# Altium schematic sheet 04_RFDiagram.SchDoc: RF diagram
size A3; Organization: Lime Microsystems; Address1: Surrey Tech Centre; Address2: Guildford GU2 7YG; Address3: Surrey; Address4: United Kingdom; Revision: v1.1; SheetNumber: 1; SheetTotal: 11
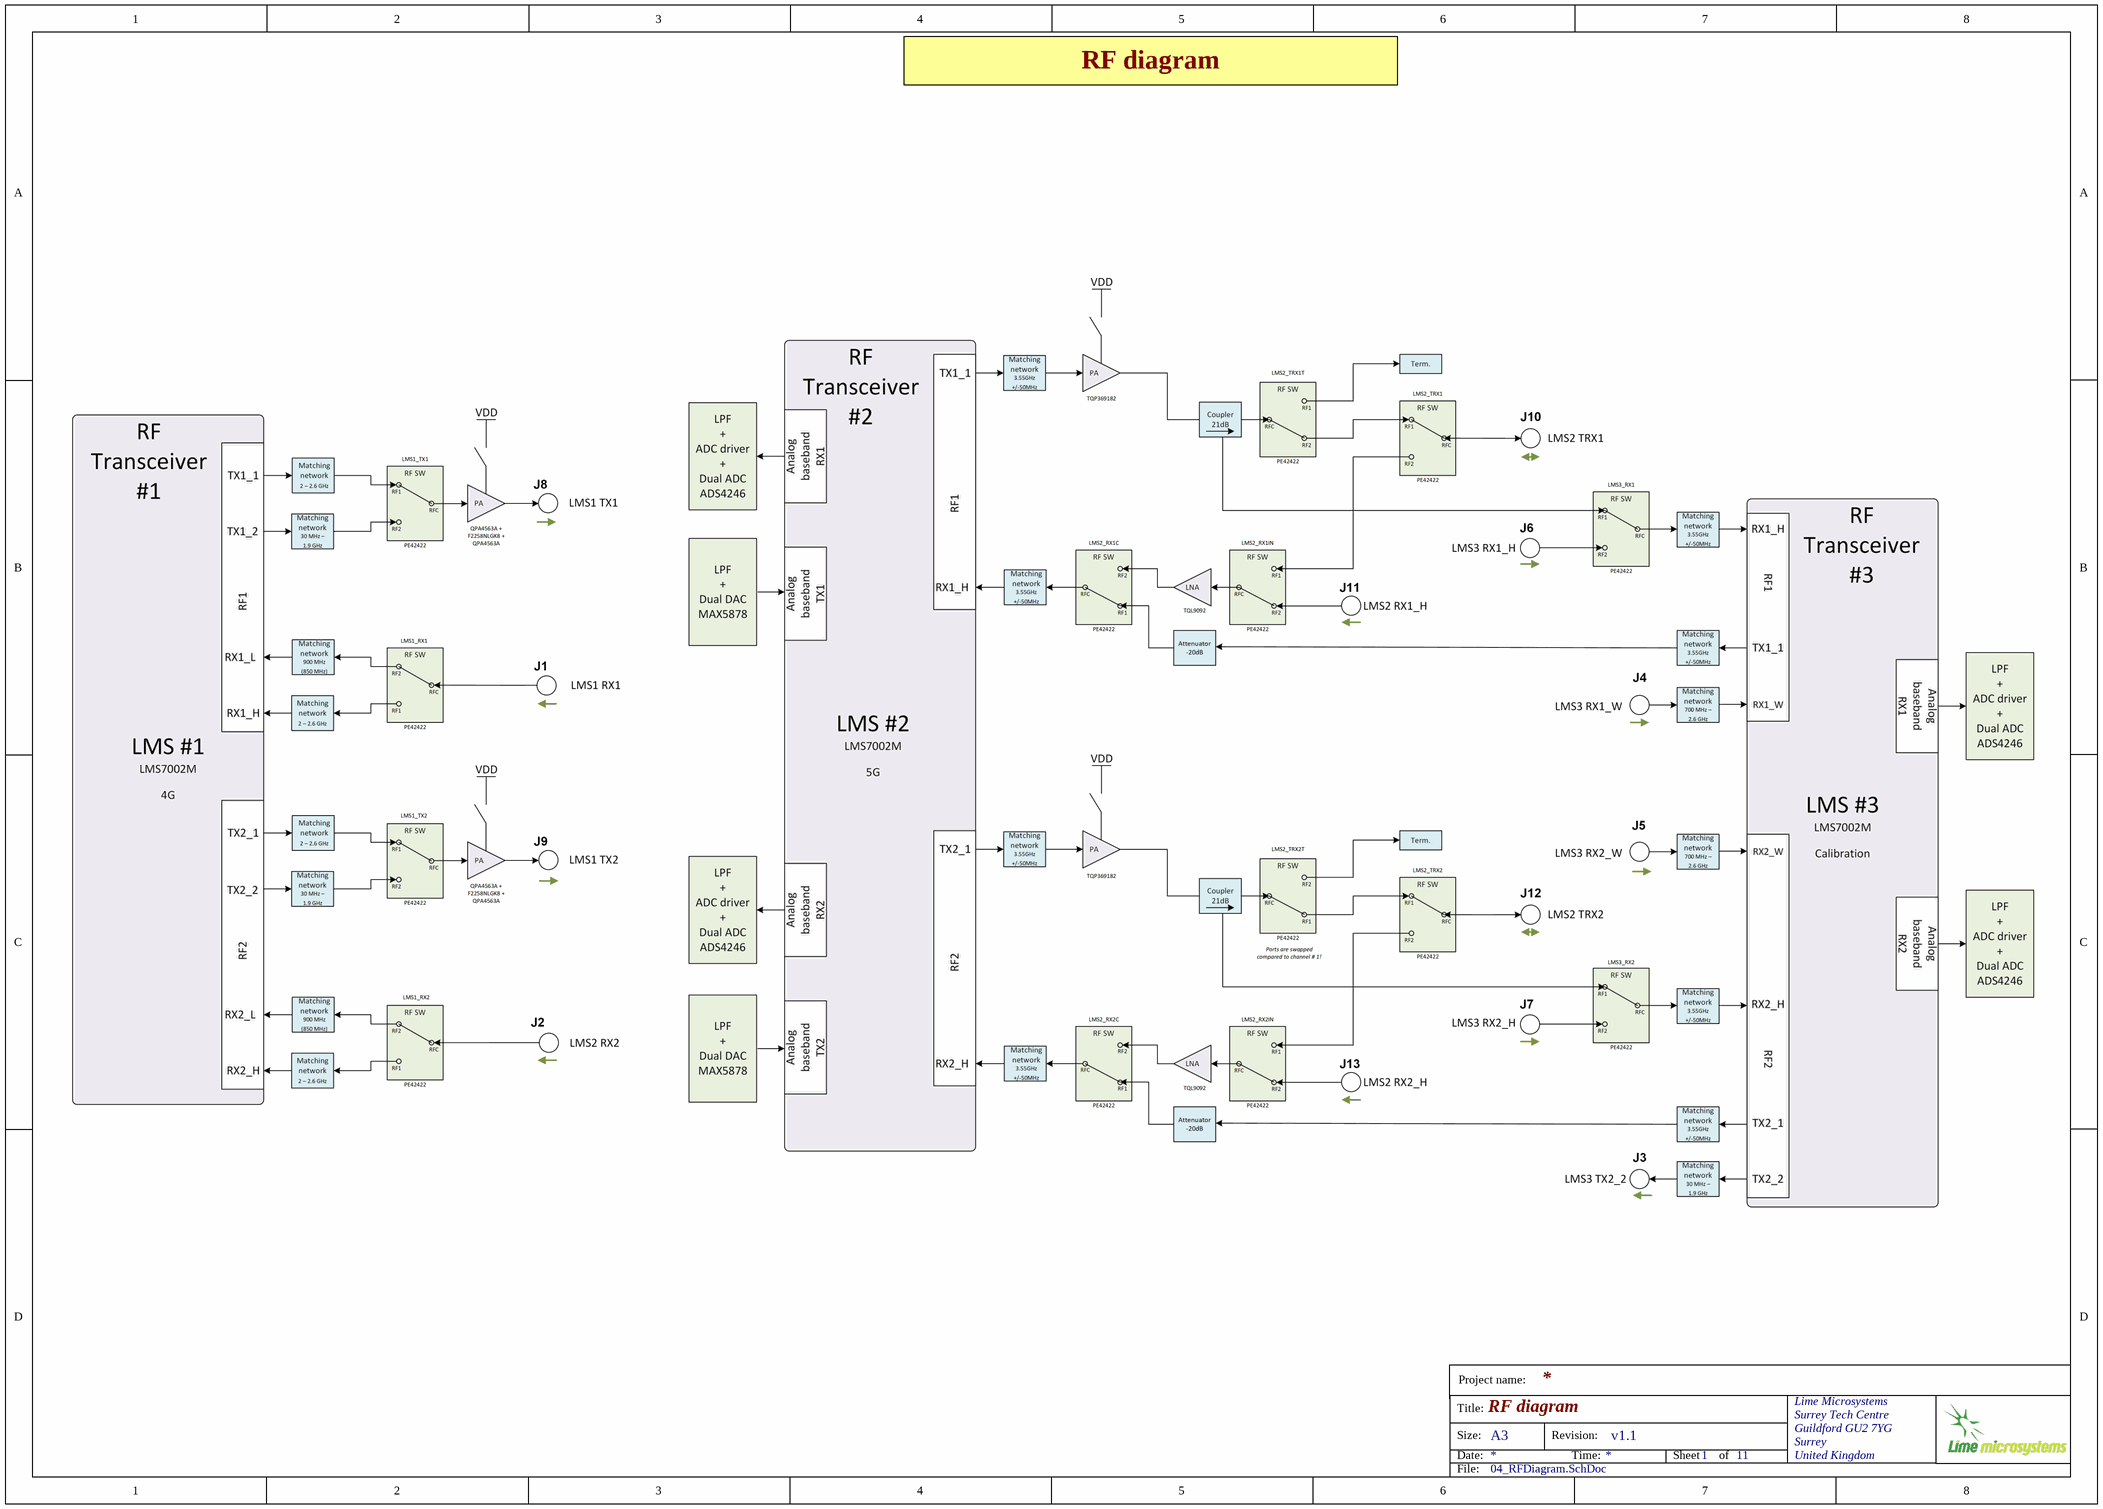
[diagram p0: 04_RFDiagram.SchDoc]

## Notes on the sheet
- RF diagram
- Project name:
- Title:
- Size:
- Date:
- A3
- Revision:
- Time:
- Sheet
- of
- File: